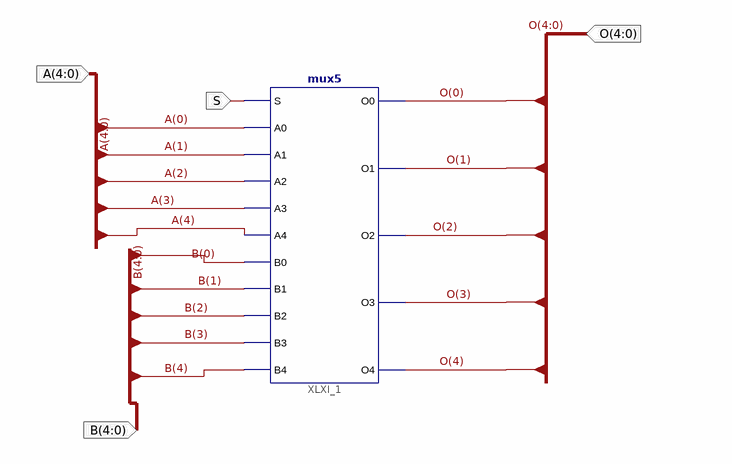
[diagram p0: schematic sheet 1]
// Xilinx ISE schematic mux5b.sch (artix7) as structural Verilog: 1 symbols, 4 ports
module mux5b (
  input  [4:0] A,
  input  [4:0] B,
  input  S,
  output [4:0] O
);

  mux5 XLXI_1 (
    .S(S), .A0(A[0]), .A1(A[1]), .A2(A[2]), .A3(A[3]), .A4(A[4]), .B0(B[0]), .B1(B[1]), .B2(B[2]), .B3(B[3]),
    .B4(B[4]), .O0(O[0]), .O1(O[1]), .O2(O[2]), .O3(O[3]), .O4(O[4]));
endmodule
